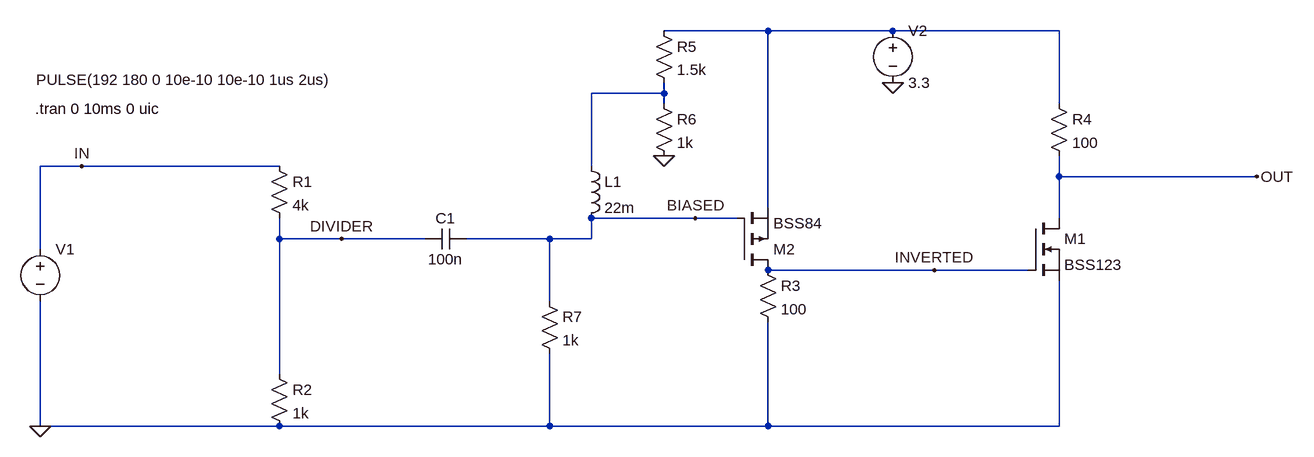
[diagram p0: schematic RX.asc]
RX.asc, the LTspice schematic file:
Version 4
SHEET 1 1172 680
WIRE 240 48 80 48
WIRE 432 48 240 48
WIRE 688 48 432 48
WIRE 80 144 80 128
WIRE 80 144 -32 144
WIRE 80 160 80 144
WIRE 688 160 688 48
WIRE -816 256 -880 256
WIRE -512 256 -816 256
WIRE -32 256 -32 144
WIRE 688 272 688 240
WIRE 992 272 688 272
WIRE 240 320 240 48
WIRE 128 336 -32 336
WIRE 192 336 128 336
WIRE 688 336 688 272
WIRE -512 368 -512 336
WIRE -416 368 -512 368
WIRE -288 368 -416 368
WIRE -96 368 -224 368
WIRE -32 368 -32 336
WIRE -32 368 -96 368
WIRE -880 384 -880 256
WIRE 496 416 240 416
WIRE 640 416 496 416
WIRE -96 464 -96 368
WIRE -512 576 -512 368
WIRE -880 656 -880 464
WIRE -512 656 -880 656
WIRE -96 656 -96 544
WIRE -96 656 -512 656
WIRE 240 656 240 496
WIRE 240 656 -96 656
WIRE 688 656 688 432
WIRE 688 656 240 656
FLAG -880 656 0
FLAG -816 256 IN
FLAG 992 272 OUT
FLAG -416 368 DIVIDER
FLAG 128 336 BIASED
FLAG 496 416 INVERTED
FLAG 432 128 0
FLAG 80 240 0
SYMBOL voltage -880 368 R0
WINDOW 3 -6 -245 Left 2
WINDOW 123 0 0 Left 2
WINDOW 39 0 0 Left 2
SYMATTR Value PULSE(192 180 0 10e-10 10e-10 1us 2us)
SYMATTR InstName V1
SYMBOL cap -224 352 R90
WINDOW 0 0 32 VBottom 2
WINDOW 3 32 32 VTop 2
SYMATTR InstName C1
SYMATTR Value 100n
SYMBOL res -528 240 R0
SYMATTR InstName R1
SYMATTR Value 4k
SYMBOL res -528 560 R0
SYMATTR InstName R2
SYMATTR Value 1k
SYMBOL voltage 432 32 R0
WINDOW 123 0 0 Left 2
WINDOW 39 0 0 Left 2
SYMATTR InstName V2
SYMATTR Value 3.3
SYMBOL res 224 400 R0
SYMATTR InstName R3
SYMATTR Value 100
SYMBOL ind -48 240 R0
SYMATTR InstName L1
SYMATTR Value 22m
SYMBOL nmos 640 336 R0
SYMATTR InstName M1
SYMATTR Value BSS123
SYMBOL res 672 144 R0
SYMATTR InstName R4
SYMATTR Value 100
SYMBOL res 64 32 R0
SYMATTR InstName R5
SYMATTR Value 1.5k
SYMBOL res 64 144 R0
SYMATTR InstName R6
SYMATTR Value 1k
SYMBOL res -112 448 R0
SYMATTR InstName R7
SYMATTR Value 1k
SYMBOL pmos 192 416 M180
SYMATTR InstName M2
SYMATTR Value BSS84
TEXT -888 168 Left 2 !.tran 0 10ms 0 uic

The netlist it stands for:
* RX.asc
V1 IN 0 PULSE(192 180 0 10e-10 10e-10 1us 2us)
C1 BIASED DIVIDER 100n
R1 IN DIVIDER 4k
R2 DIVIDER 0 1k
V2 N001 0 3.3
R3 INVERTED 0 100
L1 N002 BIASED 22m
M1 OUT INVERTED 0 0 BSS123
R4 N001 OUT 100
R5 N001 N002 1.5k
R6 N002 0 1k
R7 BIASED 0 1k
M2 INVERTED BIASED N001 N001 BSS84
.model NMOS NMOS
.model PMOS PMOS
.lib standard.mos
.tran 0 10ms 0 uic
.backanno
.end